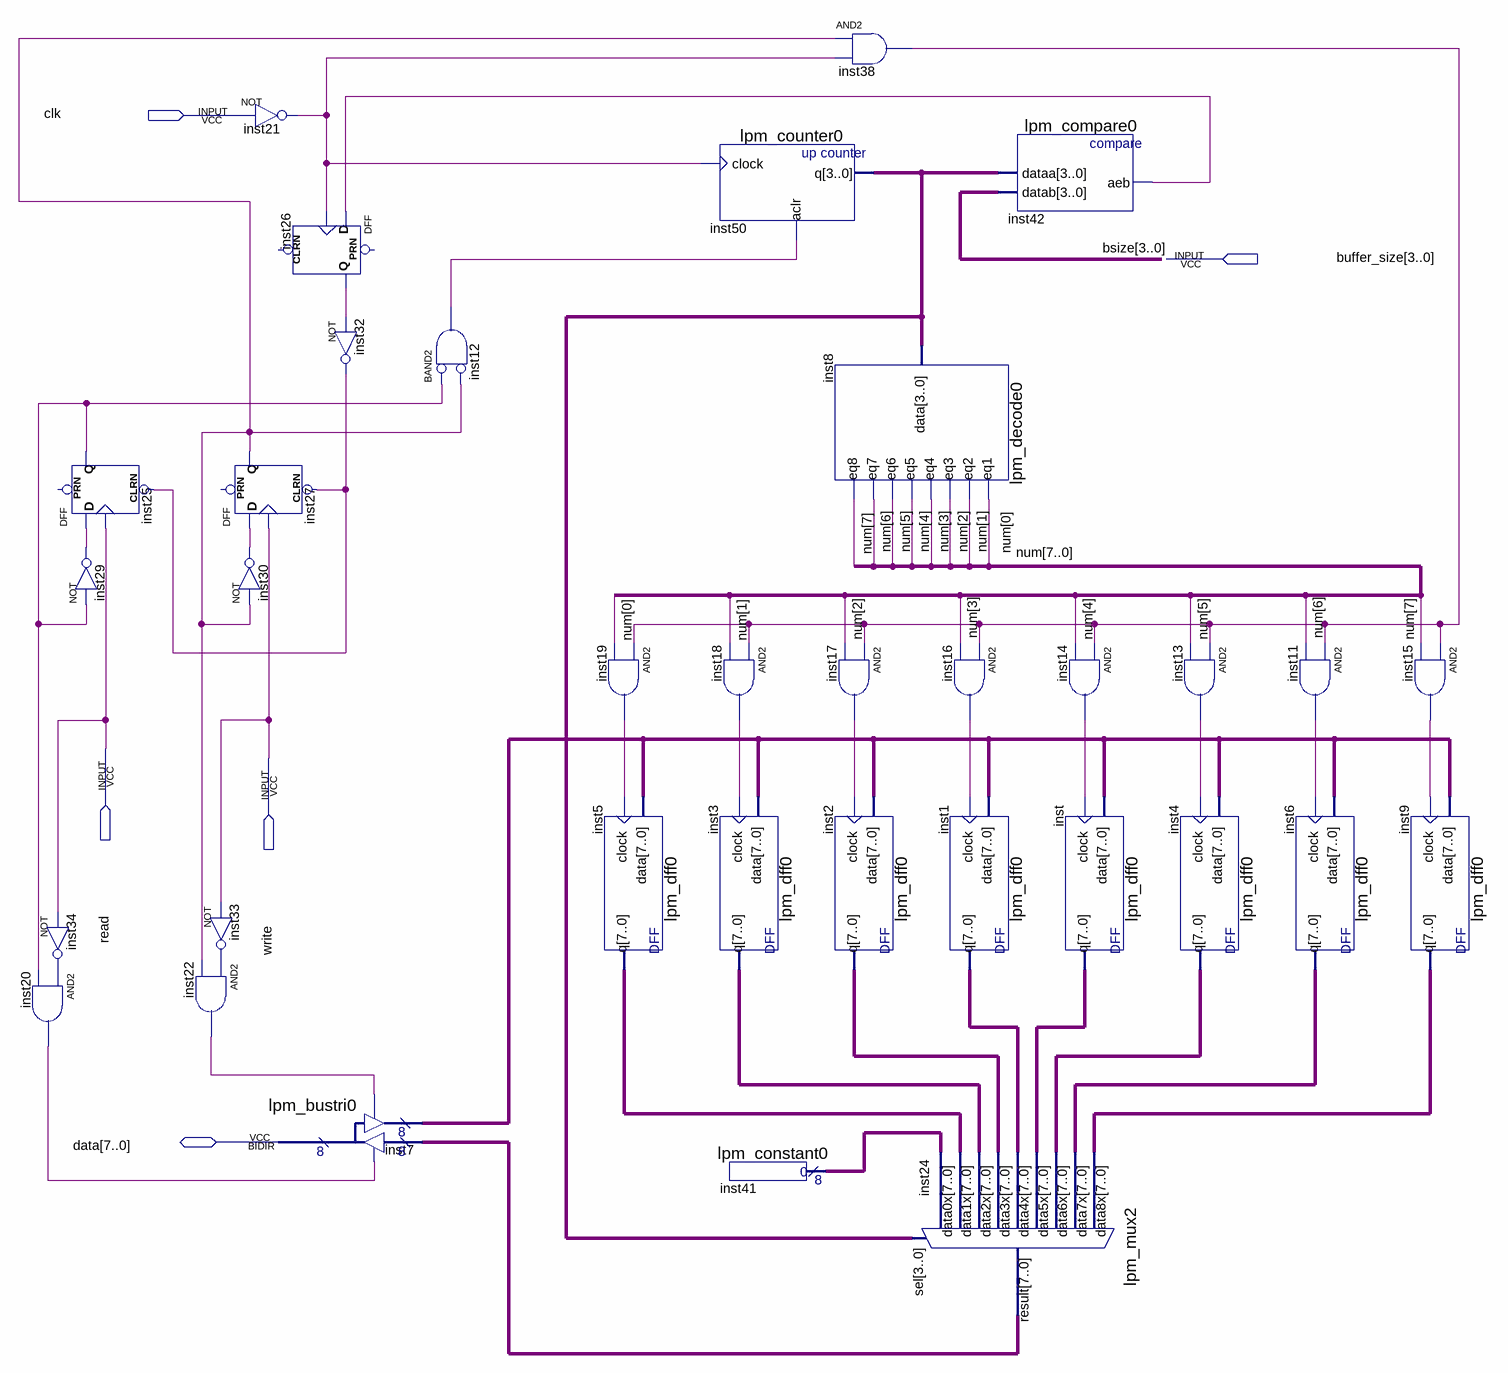
[diagram p0: schematic sheet]
// Quartus schematic Buffer.bdf as structural Verilog: 35 symbols, 5 pins
module Buffer (
  input  clk,
  input  [3:0] buffer_size,
  input  read,
  input  write,
  inout  [7:0] data
);

  wire inst11_out, inst12_out, inst13_out, inst14_out, inst15_out, inst16_out, inst17_out, inst18_out,
       inst19_out, inst20_out, inst21_out, inst22_out, inst25_q, inst26_q, inst27_q, inst29_out, inst30_out,
       inst32_out, inst33_out, inst34_out, inst38_out, inst42_aeb;
  wire [3:0] inst50_q;
  wire [7:0] inst1_q, inst2_q, inst3_q, inst4_q, inst5_q, inst6_q, inst7_result, inst9_q, inst24_result,
       inst41_result, inst_q, num;

  DFF inst25 (.CLRN(inst32_out), .CLK(read), .D(inst29_out), .Q(inst25_q));  // open: PRN
  not inst29 (inst29_out, inst25_q);
  not inst34 (inst34_out, read);
  and inst20 (inst20_out, inst34_out, inst25_q);
  not inst21 (inst21_out, clk);
  DFF inst27 (.CLRN(inst32_out), .CLK(write), .D(inst30_out), .Q(inst27_q));  // open: PRN
  not inst30 (inst30_out, inst27_q);
  not inst33 (inst33_out, write);
  and inst22 (inst22_out, inst33_out, inst27_q);
  DFF inst26 (.CLK(inst21_out), .D(inst42_aeb), .Q(inst26_q));  // open: CLRN, PRN
  lpm_bustri0 inst7 (
    .enabledt(inst20_out), .data(inst24_result), .enabletr(inst22_out), .result(inst7_result), .tridata(data));
  not inst32 (inst32_out, inst26_q);
  and inst12 (inst12_out, ~inst25_q, ~inst27_q);  // BAND2
  and inst19 (inst19_out, inst38_out, num[0]);
  lpm_dff0 inst5 (.data(inst7_result), .clock(inst19_out), .q(inst5_q));
  lpm_counter0 inst50 (.clock(inst21_out), .aclr(inst12_out), .q(inst50_q));
  lpm_dff0 inst3 (.data(inst7_result), .clock(inst18_out), .q(inst3_q));
  and inst18 (inst18_out, inst38_out, num[1]);
  lpm_constant0 inst41 (.result(inst41_result));
  and inst38 (inst38_out, inst27_q, inst21_out);
  lpm_decode0 inst8 (
    .data(inst50_q), .eq1(num[0]), .eq2(num[1]), .eq3(num[2]), .eq4(num[3]), .eq5(num[4]), .eq6(num[5]),
    .eq7(num[6]), .eq8(num[7]));
  and inst17 (inst17_out, inst38_out, num[2]);
  lpm_dff0 inst2 (.data(inst7_result), .clock(inst17_out), .q(inst2_q));
  lpm_dff0 inst1 (.data(inst7_result), .clock(inst16_out), .q(inst1_q));
  lpm_mux2 inst24 (
    .data8x(inst9_q), .data7x(inst6_q), .data6x(inst4_q), .data5x(inst_q), .data4x(inst1_q),
    .data3x(inst2_q), .data2x(inst3_q), .data1x(inst5_q), .data0x(inst41_result), .sel(inst50_q),
    .result(inst24_result));
  lpm_compare0 inst42 (.dataa(inst50_q), .datab(buffer_size), .aeb(inst42_aeb));
  and inst16 (inst16_out, inst38_out, num[3]);
  and inst14 (inst14_out, inst38_out, num[4]);
  lpm_dff0 inst (.data(inst7_result), .clock(inst14_out), .q(inst_q));
  lpm_dff0 inst4 (.data(inst7_result), .clock(inst13_out), .q(inst4_q));
  and inst13 (inst13_out, inst38_out, num[5]);
  and inst11 (inst11_out, inst38_out, num[6]);
  lpm_dff0 inst6 (.data(inst7_result), .clock(inst11_out), .q(inst6_q));
  lpm_dff0 inst9 (.data(inst7_result), .clock(inst15_out), .q(inst9_q));
  and inst15 (inst15_out, inst38_out, num[7]);

  // Other names for the same wires on the sheet: bsize[3:0] = buffer_size
endmodule
